# Altium schematic sheet Page01 COVER.SchDoc
size 513 x 386 mm; SheetNumber: 1; SheetTotal: 13
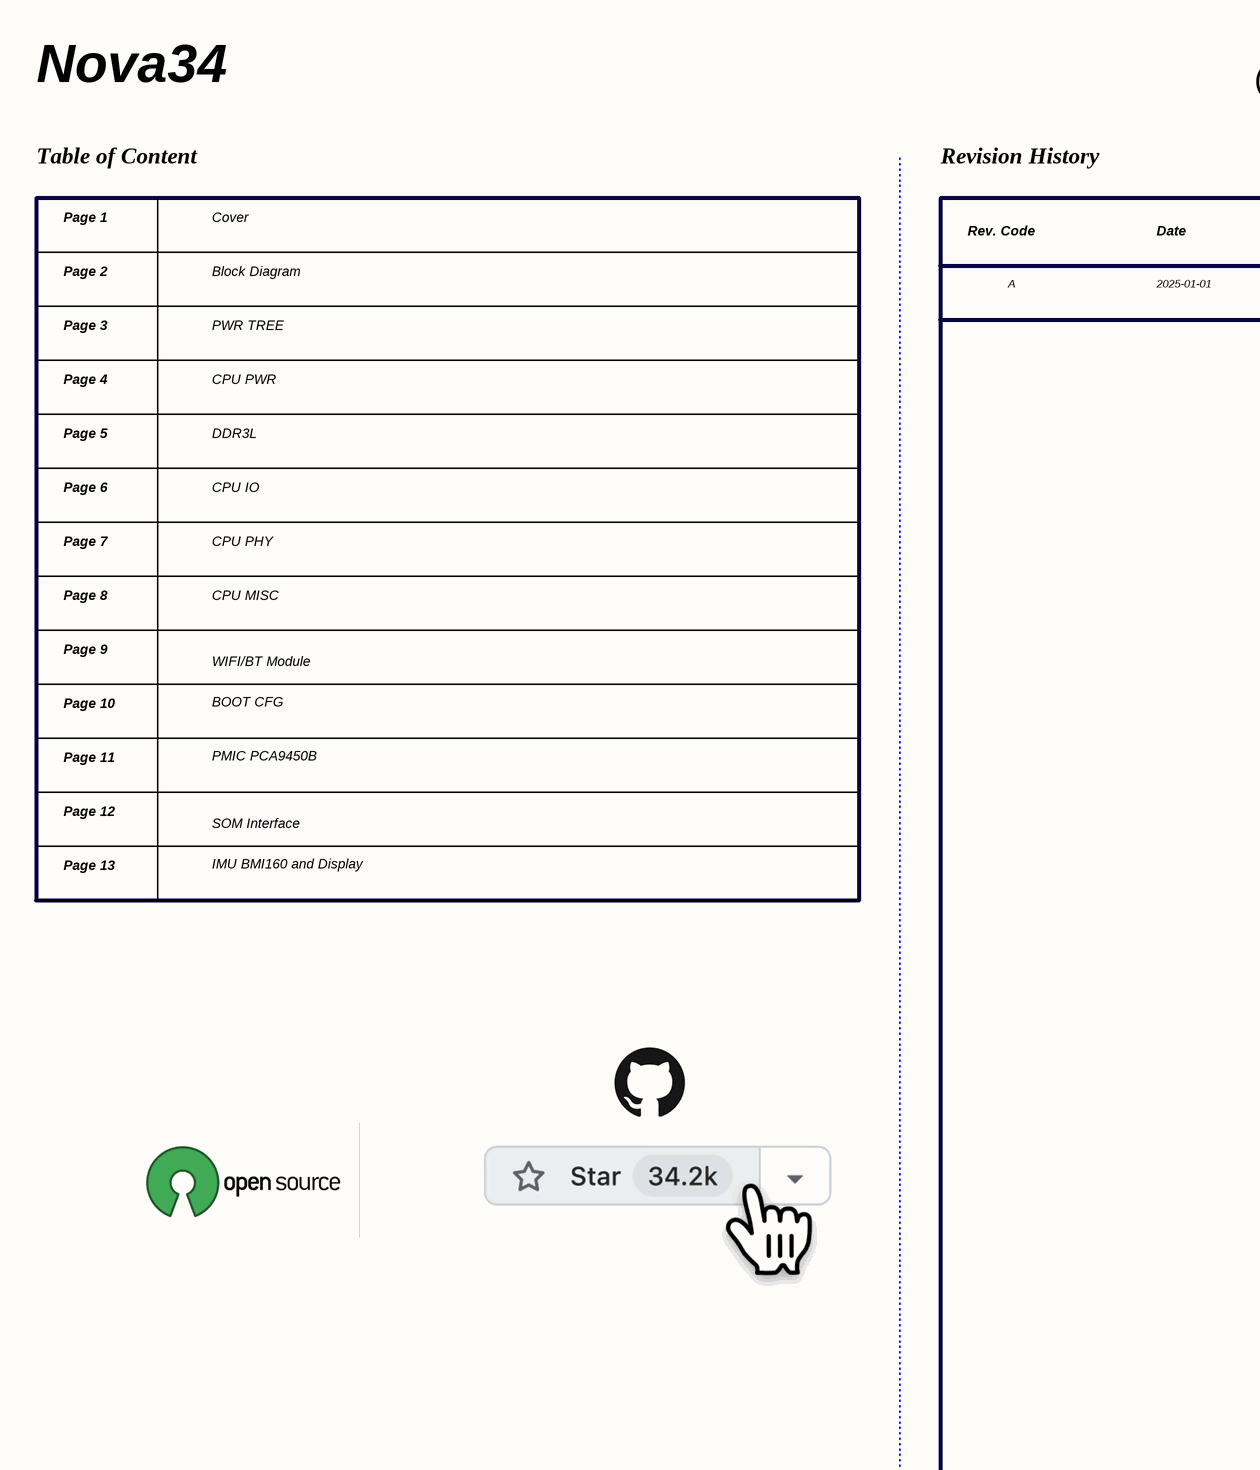
[diagram p0: Page01 COVER.SchDoc, left]
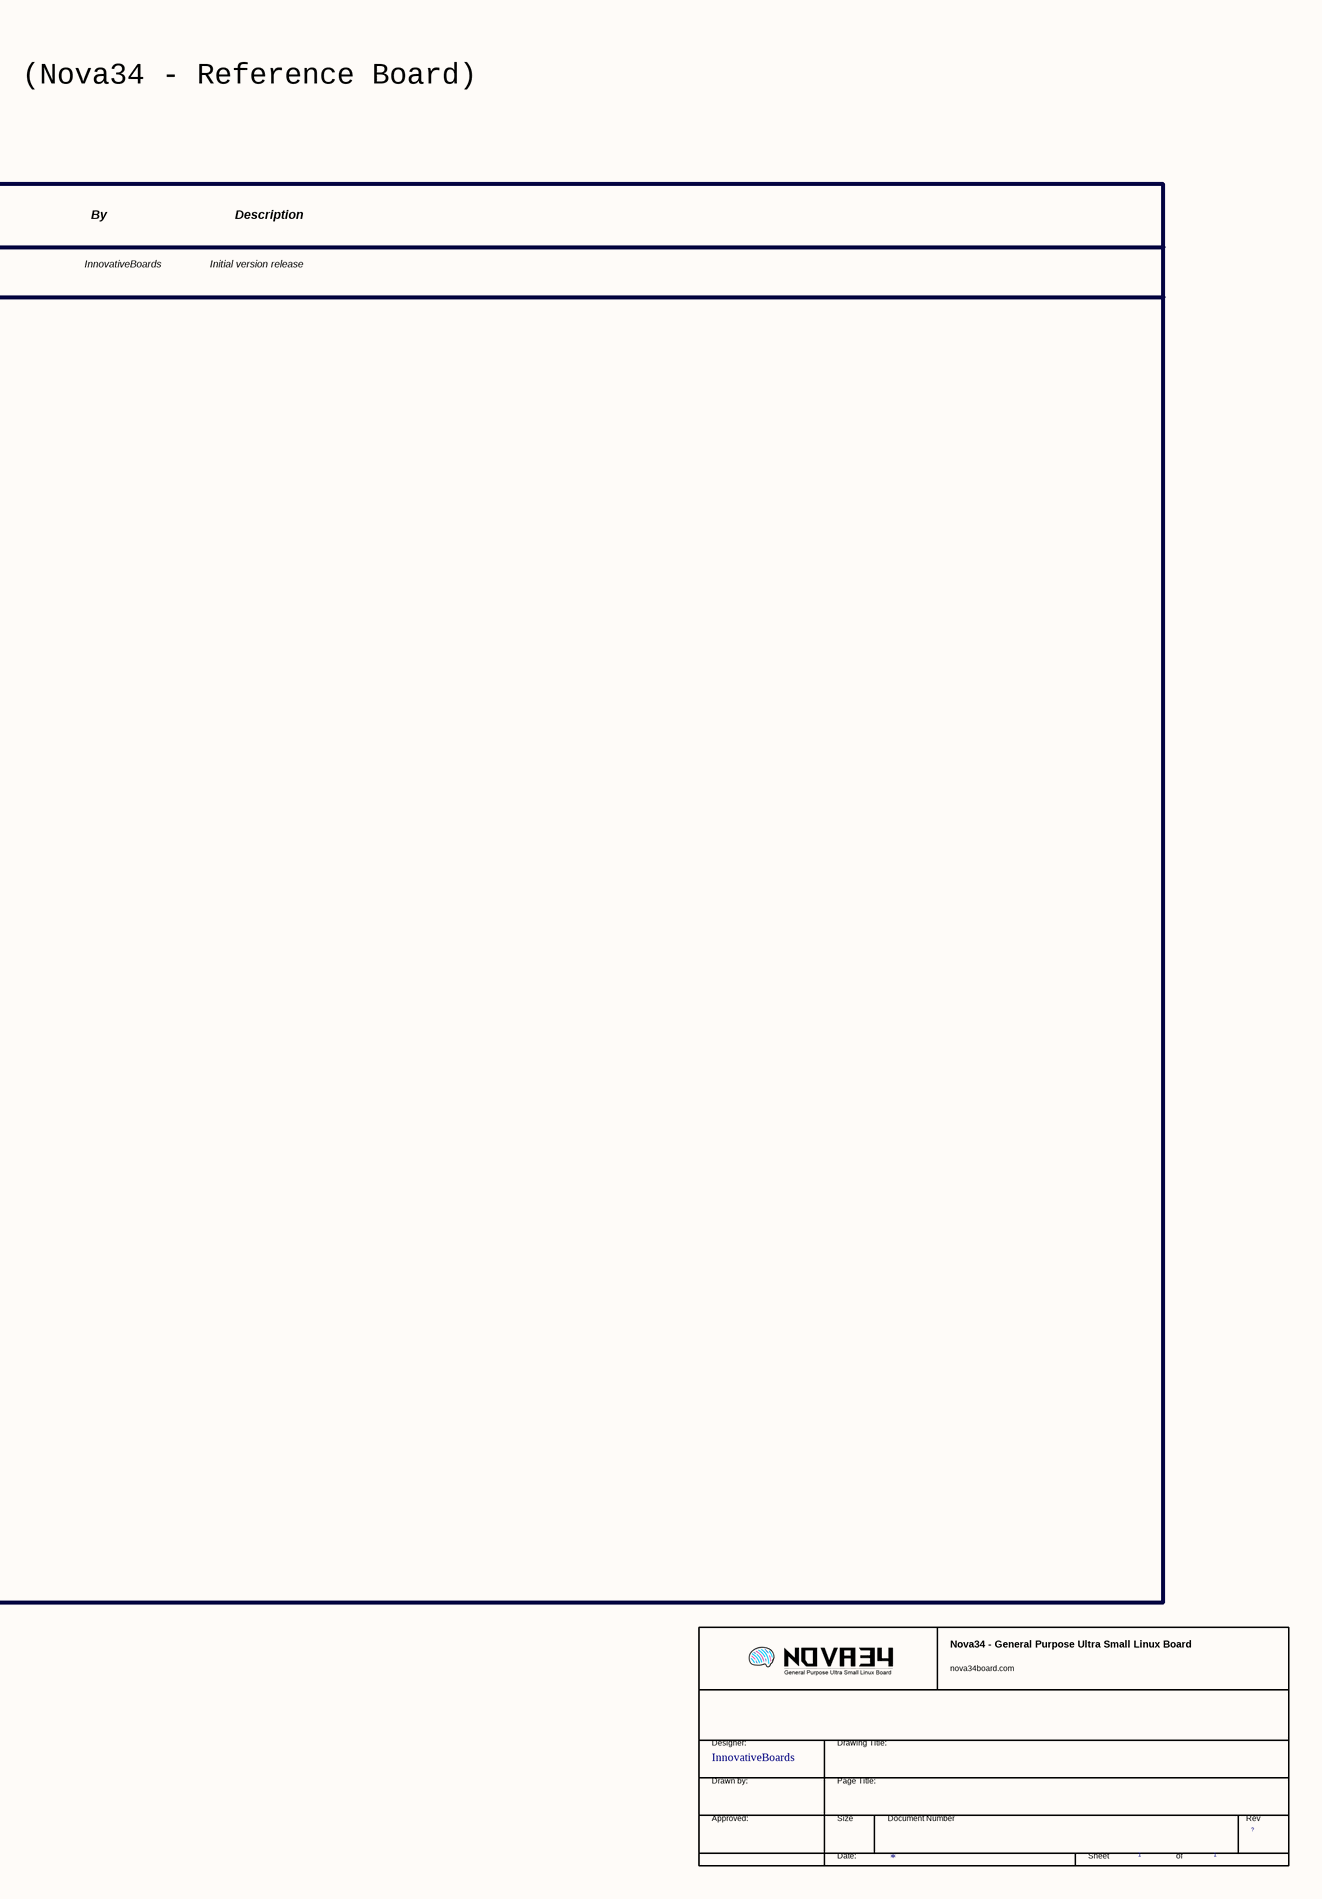
[diagram p1: Page01 COVER.SchDoc, right]

## Parts
*  Page Count: 1  (hidden comment: TitleBlock_MCPG)  (graphical)

## Notes on the sheet
- Nova34
- (Nova34 - Reference Board)
- Table of Content
- Page 1
- Cover
- Revision History
- Page 2
- Block Diagram
- Rev. Code
- A
- Date
- 2025-01-01
- InnovativeBoards
- By
- Initial version release
- Description
- Page 3
- PWR TREE
- Page 4
- CPU PWR
- Page 5
- Page 6
- DDR3L
- CPU IO
- Page 7
- CPU PHY
- Page 8
- CPU MISC
- Page 9
- WIFI/BT Module
- Page 10
- Page 11
- BOOT CFG
- PMIC PCA9450B
- Page 12
- SOM Interface
- Page 13
- IMU BMI160 and Display
- (in symbol TitleBlock_MCPG) Nova34 - General Purpose Ultra Small Linux Board; nova34board.com; Designer:; Drawing Title:; InnovativeBoards; Drawn by:; Page Title:; Approved:; Size; Document Number; Rev; Date:; Sheet; of

## Library data of the parts
* = TitleBlock_MCPG: Page Create Date: March  8, 1995; Page Number: 1; RevCode: ?; Page Modify Date: *